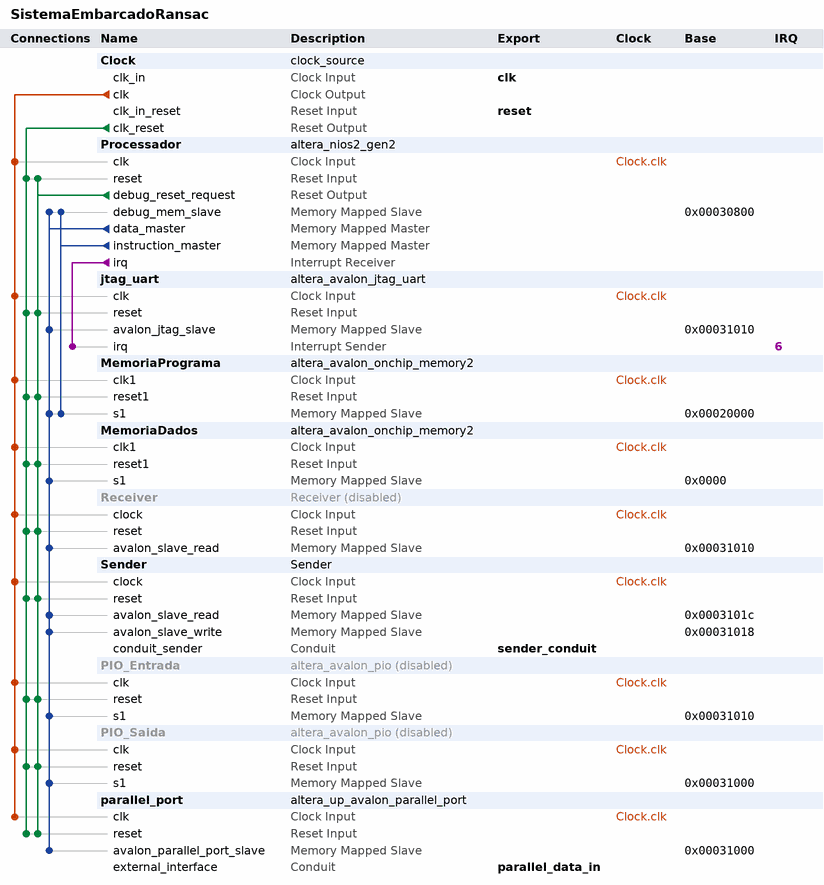
[diagram p0: system contents]
# Platform Designer (Qsys) system SistemaEmbarcadoRansac, Cyclone IV E EP4CE115F29C7
# Parameters at their usual value, and those the tool derives, are not listed.
package require -exact qsys 18.1
create_system SistemaEmbarcadoRansac
set_project_property DEVICE_FAMILY {Cyclone IV E}
set_project_property DEVICE EP4CE115F29C7

add_instance Clock clock_source 18.1
set_instance_parameter_value Clock clockFrequency 50000000

add_instance Processador altera_nios2_gen2 18.1
set_instance_parameter_value Processador dcache_size 2048
set_instance_parameter_value Processador exceptionSlave MemoriaPrograma.s1
set_instance_parameter_value Processador icache_size 4096
set_instance_parameter_value Processador impl Tiny
set_instance_parameter_value Processador resetSlave MemoriaPrograma.s1

add_instance jtag_uart altera_avalon_jtag_uart 18.1
set_instance_parameter_value jtag_uart simInteractiveOptions NO_INTERACTIVE_WINDOWS

add_instance MemoriaPrograma altera_avalon_onchip_memory2 18.1
set_instance_parameter_value MemoriaPrograma dataWidth 32
set_instance_parameter_value MemoriaPrograma dualPort false
set_instance_parameter_value MemoriaPrograma initMemContent true
set_instance_parameter_value MemoriaPrograma initializationFileName onchip_mem.hex
set_instance_parameter_value MemoriaPrograma memorySize 65536

add_instance MemoriaDados altera_avalon_onchip_memory2 18.1
set_instance_parameter_value MemoriaDados dataWidth 32
set_instance_parameter_value MemoriaDados dualPort false
set_instance_parameter_value MemoriaDados initMemContent true
set_instance_parameter_value MemoriaDados initializationFileName onchip_mem.hex
set_instance_parameter_value MemoriaDados memorySize 65536

add_instance Receiver Receiver 1.0
set_instance_property Receiver ENABLED false

add_instance Sender Sender 1.0

add_instance PIO_Entrada altera_avalon_pio 18.1
set_instance_property PIO_Entrada ENABLED false
set_instance_parameter_value PIO_Entrada direction Input
set_instance_parameter_value PIO_Entrada simDoTestBenchWiring true
set_instance_parameter_value PIO_Entrada simDrivenValue 1
set_instance_parameter_value PIO_Entrada width 1

add_instance PIO_Saida altera_avalon_pio 18.1
set_instance_property PIO_Saida ENABLED false
set_instance_parameter_value PIO_Saida direction Output
set_instance_parameter_value PIO_Saida width 1

add_instance parallel_port altera_up_avalon_parallel_port 18.0
set_instance_parameter_value parallel_port board DE2-115
set_instance_parameter_value parallel_port capture false
set_instance_parameter_value parallel_port custom_port true
set_instance_parameter_value parallel_port edge Rising
set_instance_parameter_value parallel_port irq false
set_instance_parameter_value parallel_port preset {Expansion Header}

# connections
add_connection Clock.clk jtag_uart.clk clock
add_connection Clock.clk MemoriaDados.clk1 clock
add_connection Clock.clk MemoriaPrograma.clk1 clock
add_connection Clock.clk parallel_port.clk clock
add_connection Clock.clk PIO_Entrada.clk clock
add_connection Clock.clk PIO_Saida.clk clock
add_connection Clock.clk Processador.clk clock
add_connection Clock.clk Receiver.clock clock
add_connection Clock.clk Sender.clock clock
add_connection Clock.clk_reset jtag_uart.reset reset
add_connection Clock.clk_reset MemoriaDados.reset1 reset
add_connection Clock.clk_reset MemoriaPrograma.reset1 reset
add_connection Clock.clk_reset parallel_port.reset reset
add_connection Clock.clk_reset PIO_Entrada.reset reset
add_connection Clock.clk_reset PIO_Saida.reset reset
add_connection Clock.clk_reset Processador.reset reset
add_connection Clock.clk_reset Receiver.reset reset
add_connection Clock.clk_reset Sender.reset reset
add_connection Processador.debug_reset_request jtag_uart.reset reset
add_connection Processador.debug_reset_request MemoriaDados.reset1 reset
add_connection Processador.debug_reset_request MemoriaPrograma.reset1 reset
add_connection Processador.debug_reset_request parallel_port.reset reset
add_connection Processador.debug_reset_request PIO_Entrada.reset reset
add_connection Processador.debug_reset_request PIO_Saida.reset reset
add_connection Processador.debug_reset_request Processador.reset reset
add_connection Processador.debug_reset_request Receiver.reset reset
add_connection Processador.debug_reset_request Sender.reset reset
add_connection Processador.data_master jtag_uart.avalon_jtag_slave avalon
set_connection_parameter_value Processador.data_master/jtag_uart.avalon_jtag_slave baseAddress 0x00031010
add_connection Processador.data_master MemoriaDados.s1 avalon
set_connection_parameter_value Processador.data_master/MemoriaDados.s1 baseAddress 0x0000
add_connection Processador.data_master MemoriaPrograma.s1 avalon
set_connection_parameter_value Processador.data_master/MemoriaPrograma.s1 baseAddress 0x00020000
add_connection Processador.data_master parallel_port.avalon_parallel_port_slave avalon
set_connection_parameter_value Processador.data_master/parallel_port.avalon_parallel_port_slave baseAddress 0x00031000
add_connection Processador.data_master PIO_Entrada.s1 avalon
set_connection_parameter_value Processador.data_master/PIO_Entrada.s1 baseAddress 0x00031010
add_connection Processador.data_master PIO_Saida.s1 avalon
set_connection_parameter_value Processador.data_master/PIO_Saida.s1 baseAddress 0x00031000
add_connection Processador.data_master Processador.debug_mem_slave avalon
set_connection_parameter_value Processador.data_master/Processador.debug_mem_slave baseAddress 0x00030800
add_connection Processador.data_master Receiver.avalon_slave_read avalon
set_connection_parameter_value Processador.data_master/Receiver.avalon_slave_read baseAddress 0x00031010
add_connection Processador.data_master Sender.avalon_slave_read avalon
set_connection_parameter_value Processador.data_master/Sender.avalon_slave_read baseAddress 0x0003101c
add_connection Processador.data_master Sender.avalon_slave_write avalon
set_connection_parameter_value Processador.data_master/Sender.avalon_slave_write baseAddress 0x00031018
add_connection Processador.instruction_master MemoriaPrograma.s1 avalon
set_connection_parameter_value Processador.instruction_master/MemoriaPrograma.s1 baseAddress 0x00020000
add_connection Processador.instruction_master Processador.debug_mem_slave avalon
set_connection_parameter_value Processador.instruction_master/Processador.debug_mem_slave baseAddress 0x00030800
add_connection Processador.irq jtag_uart.irq interrupt
set_connection_parameter_value Processador.irq/jtag_uart.irq irqNumber 6

# exported interfaces
add_interface clk clock sink
set_interface_property clk EXPORT_OF Clock.clk_in
add_interface parallel_data_in conduit end
set_interface_property parallel_data_in EXPORT_OF parallel_port.external_interface
add_interface reset reset sink
set_interface_property reset EXPORT_OF Clock.clk_in_reset
add_interface sender_conduit conduit end
set_interface_property sender_conduit EXPORT_OF Sender.conduit_sender

set_interconnect_requirement {$system} qsys_mm.clockCrossingAdapter HANDSHAKE
set_interconnect_requirement {$system} qsys_mm.enableEccProtection FALSE
set_interconnect_requirement {$system} qsys_mm.insertDefaultSlave FALSE
set_interconnect_requirement {$system} qsys_mm.maxAdditionalLatency 1

save_system SistemaEmbarcadoRansac.qsys
